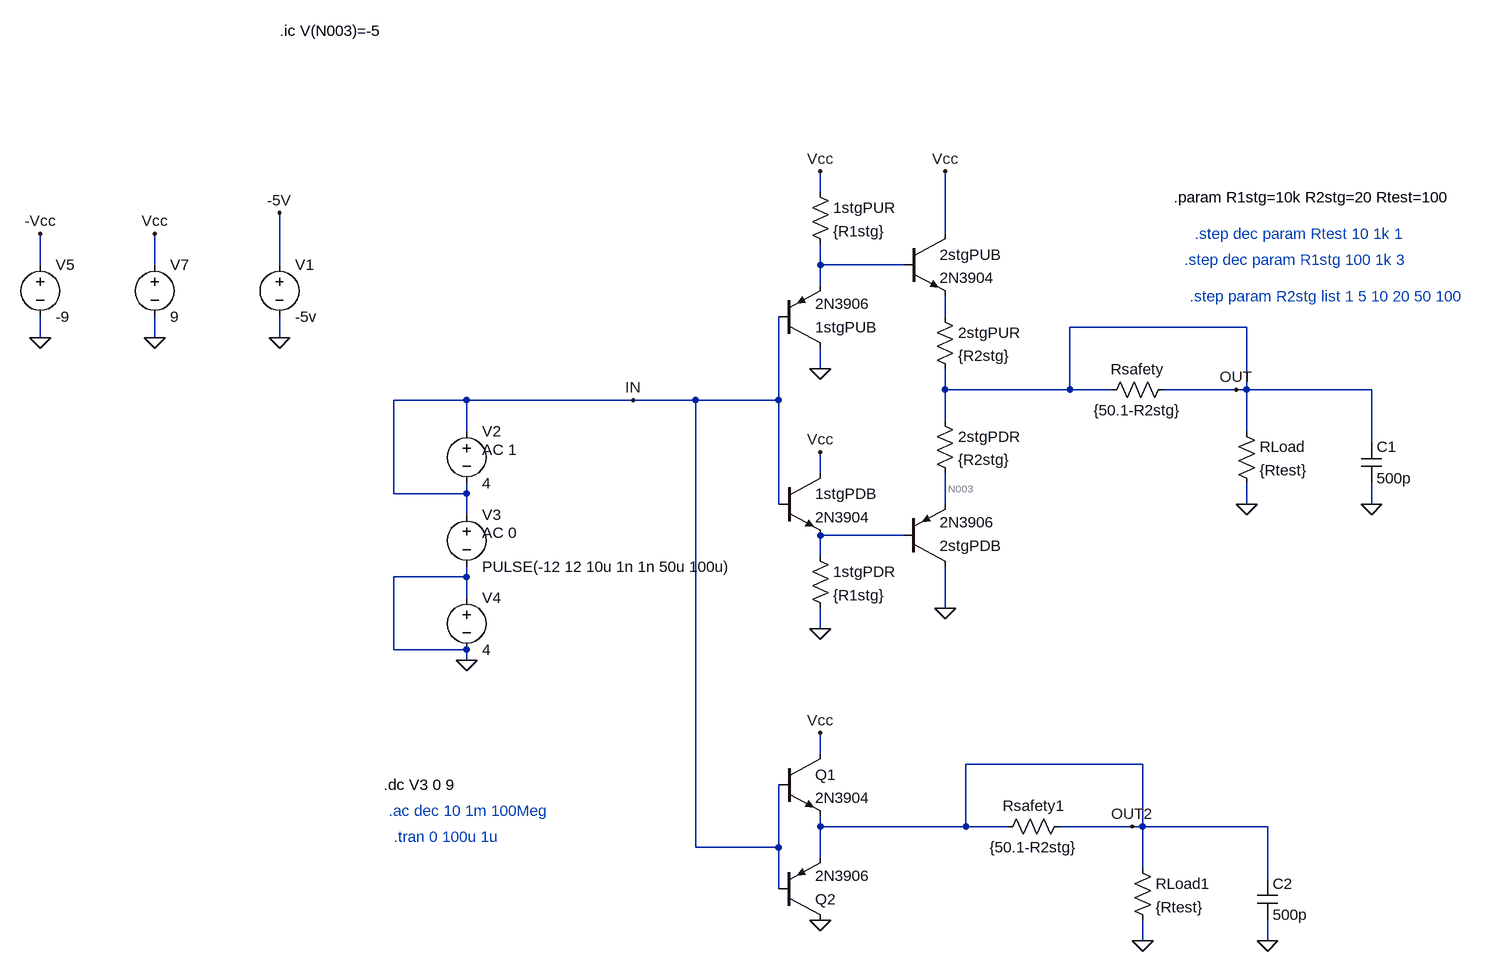
[diagram p0: schematic DCLoadbuff.asc]
* DCLoadbuff.asc
Q§1stgPDB Vcc IN N004 0 2N3904
Q§2stgPDB 0 N004 N003 0 2N3906
R§1stgPDR N004 0 {R1stg}
R§1stgPUR Vcc N001 {R1stg}
Q§2stgPUB Vcc N001 N002 0 2N3904
Q§1stgPUB 0 IN N001 0 2N3906
R§2stgPUR N002 OUT {R2stg}
R§2stgPDR OUT N003 {R2stg}
V7 Vcc 0 9
V1 -5V 0 -5v
V2 IN IN 4 AC 1
RLoad OUT 0 {Rtest}
V3 IN 0 PULSE(-12 12 10u 1n 1n 50u 100u) AC 0
V4 0 0 4
V5 -Vcc 0 -9
Rsafety OUT OUT {50.1-R2stg}
C1 OUT 0 500p
Q1 Vcc IN OUT2 0 2N3904
Q2 0 IN OUT2 0 2N3906
RLoad1 OUT2 0 {Rtest}
Rsafety1 OUT2 OUT2 {50.1-R2stg}
C2 OUT2 0 500p
.model NPN NPN
.model PNP PNP
.lib standard.bjt
.ic V(N003)=-5
.dc V3 0 9
* .step dec param Rtest 10 1k 1
.param R1stg=10k R2stg=20 Rtest=100
* .step dec param R1stg 100 1k 3
* .ac dec 10 1m 100Meg
* .step param R2stg list 1 5 10 20 50 100
* .tran 0 100u 1u
.backanno
.end

* Results of the author's LTspice run, read from the files saved beside the schematic
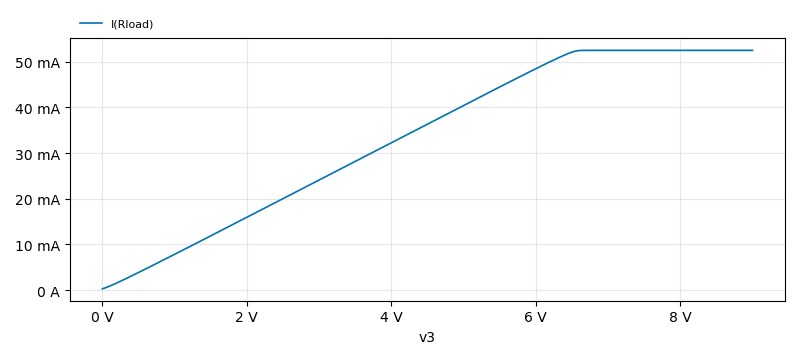
[diagram p1: DC transfer characteristic of DCLoadbuff.asc, plotted from the saved traces]
* DC transfer characteristic, 1 run:
*   I(Rload): 265.2 µA at v3=0 V, 52.5 mA at v3=9 V, min 265.2 µA, max 52.5 mA